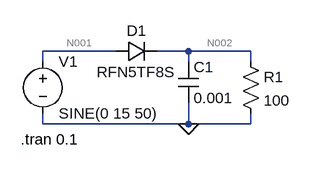
[diagram p0: schematic Half_Wave_Rectiier.asc]
Half_Wave_Rectiier.asc, the LTspice schematic file:
Version 4
SHEET 1 880 680
WIRE 144 96 32 96
WIRE 256 96 208 96
WIRE 352 96 256 96
WIRE 32 112 32 96
WIRE 256 112 256 96
WIRE 352 112 352 96
WIRE 32 208 32 192
WIRE 256 208 256 176
WIRE 256 208 32 208
WIRE 352 208 352 192
WIRE 352 208 256 208
FLAG 256 208 0
SYMBOL voltage 32 96 R0
WINDOW 123 0 0 Left 2
WINDOW 39 0 0 Left 2
SYMATTR InstName V1
SYMATTR Value SINE(0 15 50)
SYMBOL diode 144 112 R270
WINDOW 0 32 32 VTop 2
WINDOW 3 0 32 VBottom 2
SYMATTR InstName D1
SYMATTR Value RFN5TF8S
SYMBOL cap 240 112 R0
SYMATTR InstName C1
SYMATTR Value 0.001
SYMBOL res 336 96 R0
SYMATTR InstName R1
SYMATTR Value 100
TEXT -2 232 Left 2 !.tran 0.1

The netlist it stands for:
* Half_Wave_Rectiier.asc
V1 N001 0 SINE(0 15 50)
D1 N001 N002 RFN5TF8S
C1 N002 0 0.001
R1 N002 0 100
.model D D
.lib standard.dio
.tran 0.1
.backanno
.end

* Results of the author's LTspice run, read from the files saved beside the schematic
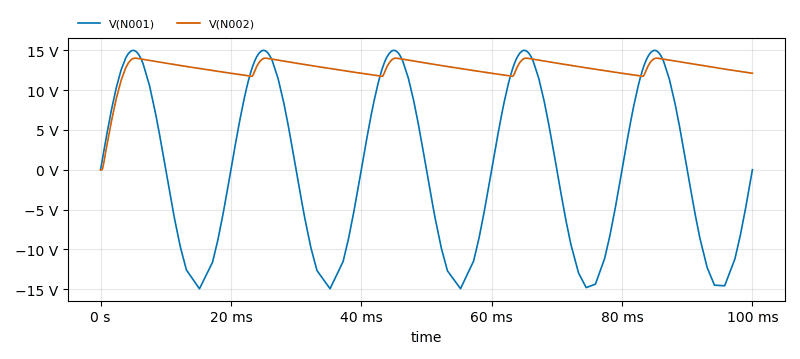
[diagram p1: Transient Analysis of Half_Wave_Rectiier.asc, plotted from the saved traces]
* Transient Analysis, 1 run:
*   V(N001): min -14.96 V, max 15 V, average 76.55 mV, rms 10.53 V, last 0 V
*   V(N002): min 0 V, max 14.01 V, average 12.68 V, rms 12.78 V, last 12.12 V